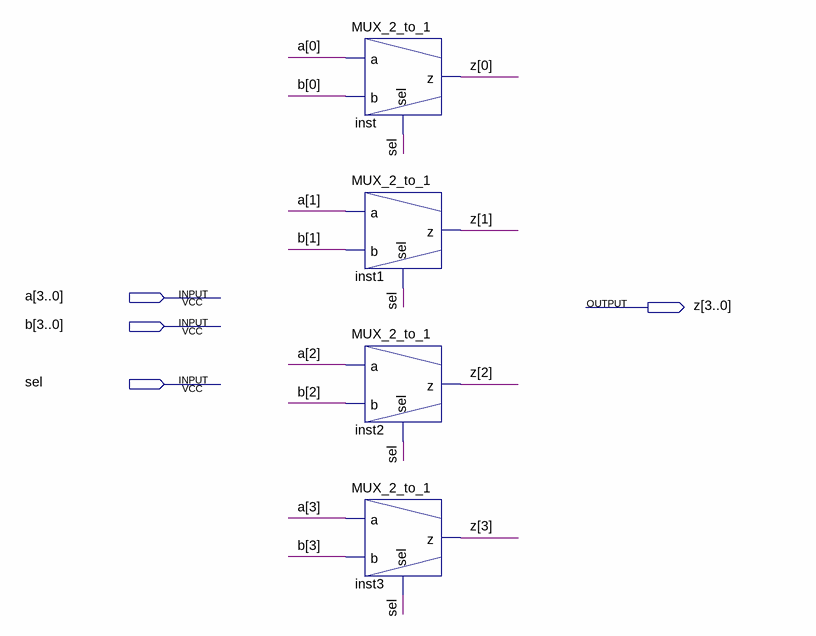
[diagram p0: schematic sheet]
// Quartus schematic MUX_2B4_to_1B4.bdf as structural Verilog: 4 symbols, 4 pins
module MUX_2B4_to_1B4 (
  input  [3:0] a,
  input  [3:0] b,
  input  sel,
  output [3:0] z
);

  MUX_2_to_1 inst (.a(a[0]), .b(b[0]), .sel(sel), .z(z[0]));
  MUX_2_to_1 inst1 (.a(a[1]), .b(b[1]), .sel(sel), .z(z[1]));
  MUX_2_to_1 inst2 (.a(a[2]), .b(b[2]), .sel(sel), .z(z[2]));
  MUX_2_to_1 inst3 (.a(a[3]), .b(b[3]), .sel(sel), .z(z[3]));
endmodule
